# EAGLE design PowerModule (EAGLE 9.6.2)
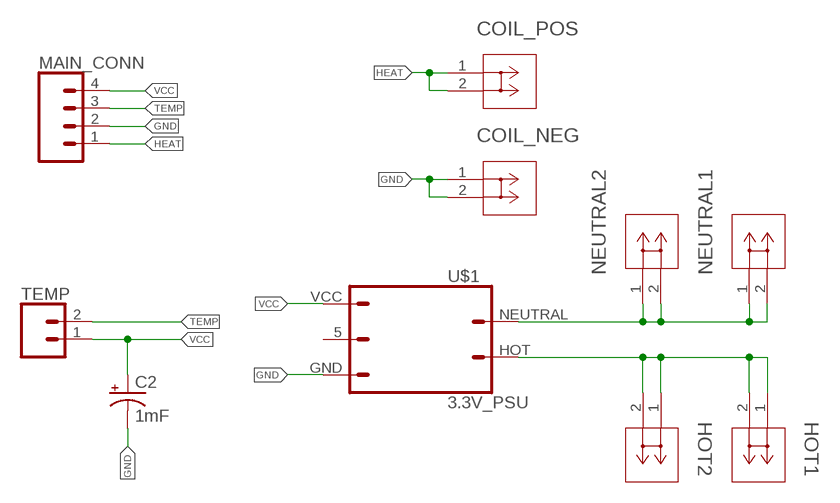
[diagram p0: schematic, sheet 1]

## Parts
C2  1mF  1000UF-RADIAL-5MM-25V-20%  [CPOL-RADIAL-5MM-10MM]
COIL_NEG  1287  [CONN_1287_KEY]
COIL_POS  1287  [CONN_1287_KEY]
HOT1  1287  [CONN_1287_KEY]
HOT2  1287  [CONN_1287_KEY]
MAIN_CONN  CONN_04PTH  [1X04]
NEUTRAL1  1287  [CONN_1287_KEY]
NEUTRAL2  1287  [CONN_1287_KEY]
TEMP  CONN_02  [1X02]
U$1  3.3V_PSU  [1X03]

## Nets
GND: C2.- COIL_NEG.1 COIL_NEG.2 MAIN_CONN.2 U$1.GND
HEAT: COIL_POS.1 COIL_POS.2 MAIN_CONN.1
HOT: HOT1.1 HOT1.2 HOT2.1 HOT2.2 U$1.HOT
NEUTRAL: NEUTRAL1.1 NEUTRAL1.2 NEUTRAL2.1 NEUTRAL2.2 U$1.NEUTRAL
TEMP: MAIN_CONN.3 TEMP.2
VCC: C2.+ MAIN_CONN.4 TEMP.1 U$1.VCC
Unconnected: U$1.5

## Library data of the parts
C2 = SparkFun-Capacitors:1000UF: 1,000µF/1mF ceramic capacitors A capacitor is a passive two-terminal electrical component used to store electrical energy temporarily in an electric field. CAP-08070; PROD_ID: CAP-09538
COIL_NEG COIL_POS HOT1 HOT2 NEUTRAL1 NEUTRAL2 = Custom:1287; COPYRIGHT: Copyright (C) 2022 Ultra Librarian. All rights reserved.; DIGI-KEY_PART_NUMBER_1: 1287K-ND; DIGI-KEY_PART_NUMBER_2: 36-1287-ND; DIGI-KEY_PART_NUMBER_3: 1528-1877-ND; DIGI-KEY_PART_NUMBER_4: 36-1287-NDL; MANUFACTURER_PART_NUMBER: 1287; MFR_NAME: Keystone Electronics
MAIN_CONN = SparkFun-Connectors:CONN_04: Multi connection point. Often used as Generic Header-pin footprint for 0.1 inch spaced/style header connections On any of the 0.1 inch spaced packages, you can populate with these: Break Away Headers - Straight <https://www.sparkfun.com/products/116> (PRT-00116) Break Away Male Headers - Right Angle <https://www.sparkfun.com/products/553> (PRT-00553) Female Headers <https://www.sparkfun.com/products/115> (PRT-00115) Break Away Headers - Machine Pin <https://www.sparkfun.com/products/117> (PRT-00117) Break Away Female Headers - Swiss Machine Pin <https://www.sparkfun.com/products/743> (PRT-00743) For SCREWTERMINALS and SPRING TERMINALS visit here: Screw Terimnals on SparkFun.com <https://www.sparkfun.com/search/results?term=Screw+Terminals> (5mm/3.5mm/2.54mm spacing) This device is also useful as a general connection point to wire up your design to another part of your project. Our various solder wires solder well into these plated through hole pads. Hook-Up Wire - Assortment (Stranded, 22 AWG) <https://www.sparkfun.com/products/11375> (PRT-11375) Hook-Up Wire - Assortment (Solid Core, 22 AWG) <https://www.sparkfun.com/products/11367> (PRT-11367) View the entire wire category on our website here <https://www.sparkfun.com/categories/141> Special notes: Molex polarized connector foot print use with SKU : PRT-08231 with associated crimp pins and housings. 1MM SMD Version SKU: PRT-10208; PROD_ID: CONN-09696
TEMP = SparkFun-Connectors:CONN_02: Multi connection point. Often used as Generic Header-pin footprint for 0.1 inch spaced/style header connections On any of the 0.1 inch spaced packages, you can populate with these: Break Away Headers - Straight <https://www.sparkfun.com/products/116> (PRT-00116) Break Away Male Headers - Right Angle <https://www.sparkfun.com/products/553> (PRT-00553) Female Headers <https://www.sparkfun.com/products/115> (PRT-00115) Break Away Headers - Machine Pin <https://www.sparkfun.com/products/117> (PRT-00117) Break Away Female Headers - Swiss Machine Pin <https://www.sparkfun.com/products/743> (PRT-00743) For SCREWTERMINALS and SPRING TERMINALS visit here: Screw Terimnals on SparkFun.com <https://www.sparkfun.com/search/results?term=Screw+Terminals> (5mm/3.5mm/2.54mm spacing) This device is also useful as a general connection point to wire up your design to another part of your project. Our various solder wires solder well into these plated through hole pads. Hook-Up Wire - Assortment (Stranded, 22 AWG) <https://www.sparkfun.com/products/11375> (PRT-11375) Hook-Up Wire - Assortment (Solid Core, 22 AWG) <https://www.sparkfun.com/products/11367> (PRT-11367) View the entire wire category on our website here <https://www.sparkfun.com/categories/141> Special notes: Molex polarized connector foot print use with: PRT-08233 with associated crimp pins and housings. 2.54_SCREWTERM for use with PRT-10571. 3.5mm Screw Terminal footprints for PRT-08084 5mm Screw Terminal footprints for use with PRT-08432
U$1 = Custom:3.3V_PSU

## Board
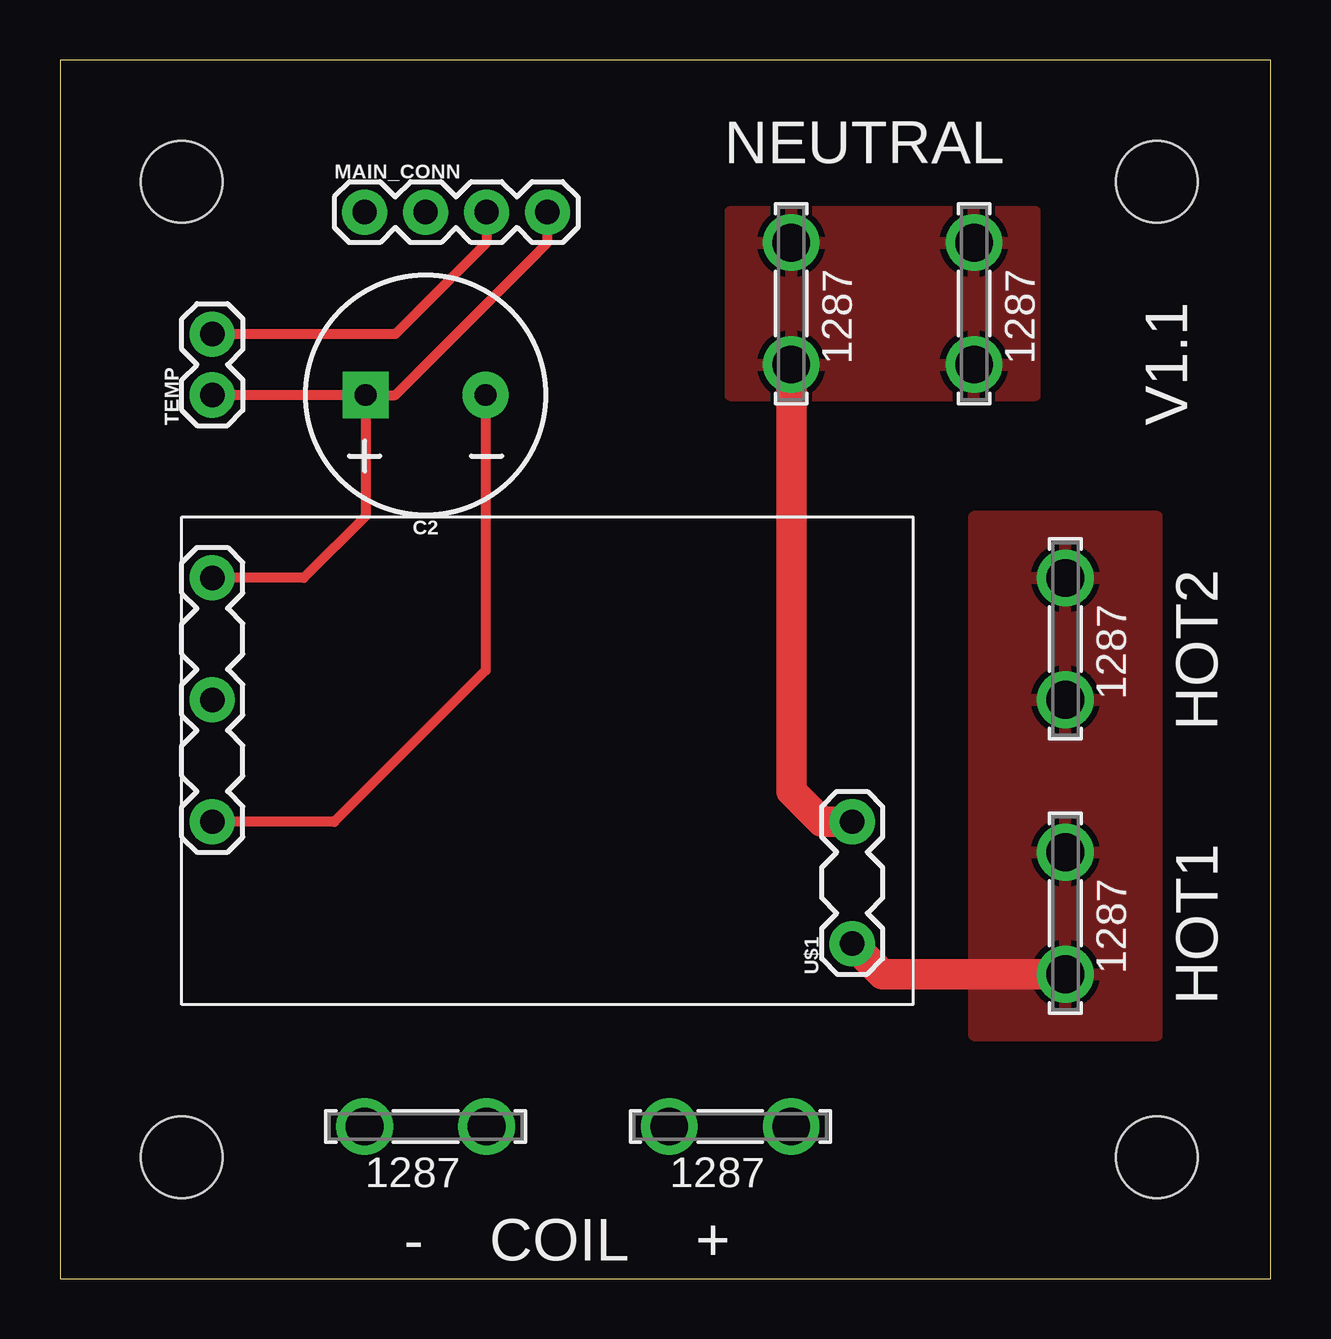
[diagram p1: board, top side]
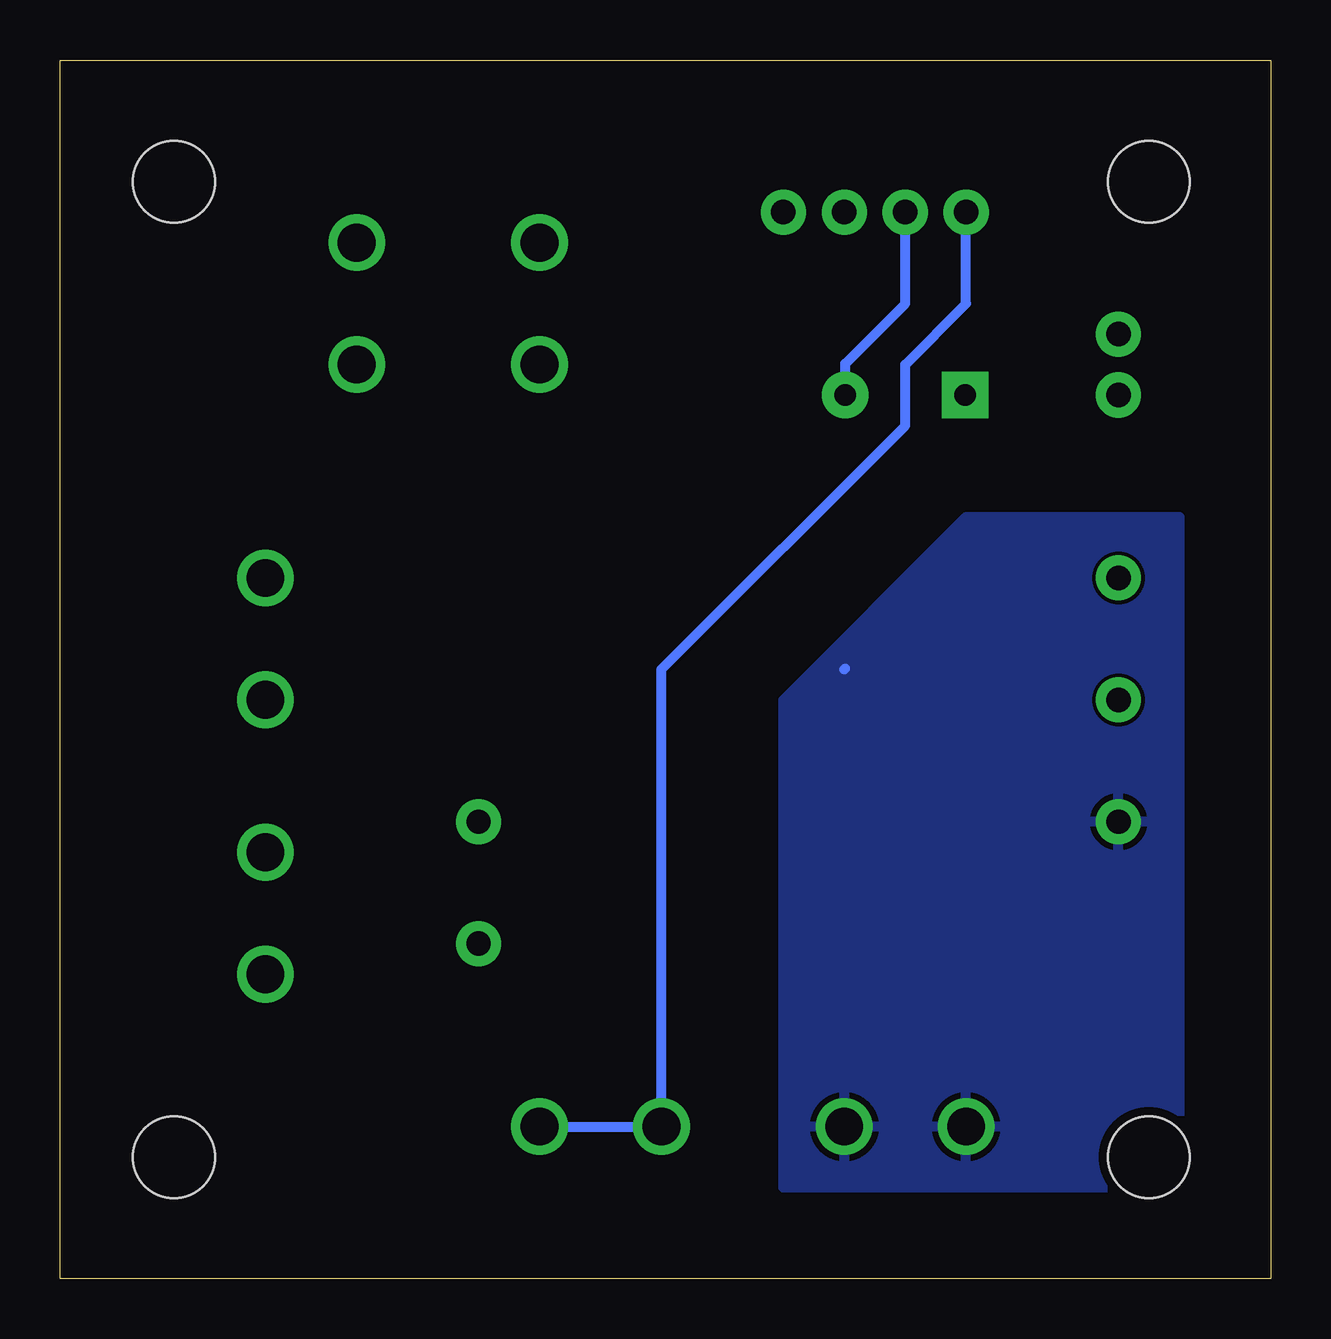
[diagram p2: board, bottom side, seen from below]

Size 50.47 x 50.79 mm. Coordinates in mm from the lower left corner, seen from the top.
Outline: 0,0 50.47,0 50.47,50.79 0,50.79 0,0
Copper layers (1*16): Top 0.035559375mm / dielectric 1.6mm / Bottom 0.035559375mm
Design rules "oshpark-2layer": minimum track width 6mil, minimum drill 10mil, track to track 6mil, track to pad 6mil, pad to pad 6mil, via to via 6mil, smd to smd 6mil, copper to edge 15mil, drill to drill 6mil, minimum pad ring 5mil, minimum via ring 5mil, stop-mask expansion 2.5mil, vias tented up to drill 0mil, thermal gap 10mil
Holes 3.4 mm at 45.72,5.08 5.08,5.08 45.72,45.72 5.08,45.72

### Footprints (pad centres in the part's own frame; a part is rotated, then mirrored left to right if it is on the bottom)
CPOL-RADIAL-5MM-10MM = drill 0.9 pad 1.93 square: + 2.5,0 | drill 0.9 pad 1.93: - -2.5,0
CONN_1287_KEY = drill 1.575 pad 2.083: 1 0,0; 2 5.08,0
1X04 = drill 1.016 pad 1.88: 1 0,0; 2 2.54,0; 3 5.08,0; 4 7.62,0
1X02 = drill 1.016 pad 1.88: 1 0,0; 2 2.54,0
1X03 = drill 1.016 pad 1.88: 5 10.16,26.67; GND 5.08,26.67; HOT 0,0; NEUTRAL 5.08,0; VCC 15.24,26.67

### Placement (x,y rotation side)
C2  15.24,36.83 180 top
COIL_NEG  12.7,6.35 0 top
COIL_POS  25.4,6.35 0 top
HOT1  41.91,12.7 90 top
HOT2  41.91,24.13 90 top
MAIN_CONN  12.7,44.45 0 top
NEUTRAL1  38.1,38.1 90 top
NEUTRAL2  30.48,38.1 90 top
TEMP  6.35,36.83 90 top
U$1  33.02,13.97 90 top

### Tracks (layer width: path | path; a pad name or v marks a point on that pad's centre or on a via)
GND
  Top 0.406: C2.- 17.74,25.36 11.43,19.05 U$1.GND
  Bottom 0.406: 17.74,25.44 17.78,25.4 | MAIN_CONN.2 15.24,40.64 17.74,38.14 C2.-
  pour Bottom: 20.32,3.81 20.32,24.13 12.7,31.75 3.81,31.75 3.81,3.81
HEAT
  Bottom 0.406: COIL_POS.2 COIL_POS.1 25.4,25.4 15.24,35.56 15.24,38.1 12.7,40.64 MAIN_CONN.1
HOT
  Top 1.27: HOT1.1 34.29,12.7 U$1.HOT
  pour Top: 38.1,31.75 38.1,10.16 45.72,10.16 45.72,31.75
NEUTRAL
  Top 1.27: NEUTRAL2.1 30.48,20.32 31.75,19.05 U$1.NEUTRAL
  pour Top: 27.94,36.83 40.64,36.83 40.64,44.45 27.94,44.45
TEMP
  Top 0.406: MAIN_CONN.3 17.78,43.18 13.97,39.37 TEMP.2
VCC
  Top 0.406: C2.+ TEMP.1 | U$1.VCC 10.16,29.21 12.74,31.79 C2.+ | C2.+ 13.97,36.83 20.32,43.18 MAIN_CONN.4

### Text on the board
tPlace: NEUTRAL | V1.1 | HOT2 | HOT1 | - COIL +